# Altium schematic sheet 16-Relay.SchDoc
size A
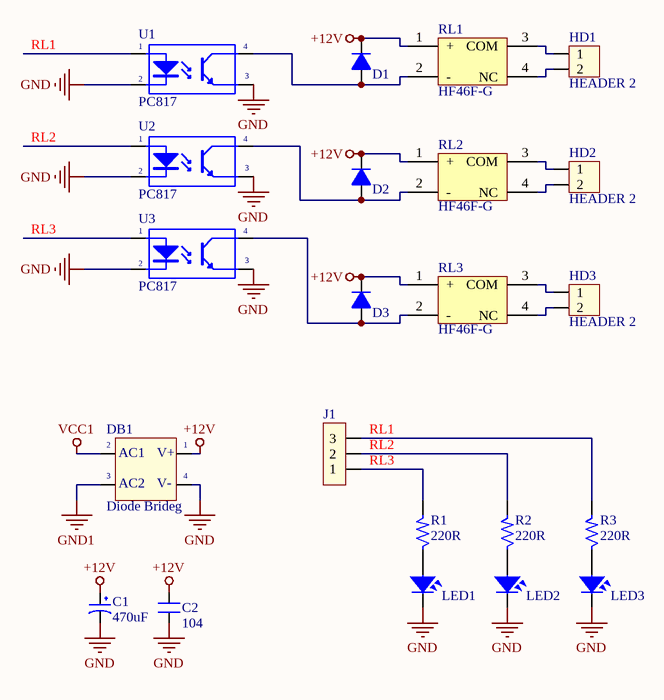
[diagram p0: 16-Relay.SchDoc]

## Parts
C1  470uF  [C-ALU-D6.5]
C2  104  [C-0805]
D1  1N4148  [D-DO213-AA]  (value not drawn)
D2  1N4148  [D-DO213-AA]  (value not drawn)
D3  1N4148  [D-DO213-AA]  (value not drawn)
DB1  Diode Brideg  [D-DB-1A-SMD]
HD1  HEADER 2  [TER-KF301-2]
HD2  HEADER 2  [TER-KF301-2]
HD3  HEADER 2  [TER-KF301-2]
J1  Jumper 3  [JP3]  (value not drawn)
LED1  LED  [LED-0805]  (value not drawn)
LED2  LED  [LED-0805]  (value not drawn)
LED3  LED  [LED-0805]  (value not drawn)
R1  220R  [R-0805]
R2  220R  [R-0805]
R3  220R  [R-0805]
RL1  HF46F-G
RL2  HF46F-G
RL3  HF46F-G
U1  PC817  [PC817]
U2  PC817  [PC817]
U3  PC817  [PC817]

## Nets
+12V: C1.1 C2.2 D1.2(K) D2.2(K) D3.2(K) DB1.3(AC2) RL1.1(+) RL2.1(+) RL3.1(+)
GND: C1.2 C2.1 DB1.4(-V_OUT) LED1.2 LED2.2 LED3.2 U1.2(K) U1.3(E) U2.2(K) U2.3(E) U3.2(K) U3.3(E)
GND1: DB1.1(+V_OUT)
VCC1: DB1.2(AC1)
RL1: J1.3 R3.2 U1.1(A)
RL2: J1.2 R2.2 U2.1(A)
RL3: J1.1 R1.2 U3.1(A)
NetD1_1: D1.1(A) RL1.2(-) U1.4(C)
NetD2_1: D2.1(A) RL2.2(-) U2.4(C)
NetD3_1: D3.1(A) RL3.2(-) U3.4(C)
NetHD1_1: HD1.1 RL1.3(COM)
NetHD1_2: HD1.2 RL1.4(NC)
NetHD2_1: HD2.1 RL2.3(COM)
NetHD2_2: HD2.2 RL2.4(NC)
NetHD3_1: HD3.1 RL3.3(COM)
NetHD3_2: HD3.2 RL3.4(NC)
NetLED1_1: LED1.1 R1.1
NetLED2_1: LED2.1 R2.1
NetLED3_1: LED3.1 R3.1

## Notes on the sheet
- (in symbol DB) V+; V-

## Library data of the parts
C1 = CP1: Cap P  0,1uF < 22uF , 16 - 50V; Value: 10uF/50V; Description 1: 10 => 220uF/6,3V/10V - 10uF => 100uF/16V; Description 2: 0,1uF => 33uF/50V - 10uF => 22uF/63V; Description 3: 0,47uF => 10uF/100V
C2 = CN: Value: 0,1uF/300V; Designed by: VanDungEvn
D1-D3 = D1A: Diode 1A; Value: 1N4007
DB1 = DB: Convert AC to DC voltage, 4 pin; Value: Cau 1A
HD1-HD3 = Hed2: Header 2 (Green); Value: Header 2
J1 = JP3: Value: J3
LED1-LED3 = LED: LED Single colour Green and Red; Value: LED 3 ly Single Colour
R1-R3 = R: Resistor 1/4W; Value: R1/4W - 1K
U1-U3 = PC817: Single Opto; Value: PC817
RL1-RL3 = HF46F-G: Value: HF46F-G